# Altium project LIB_TEST.PrjPcb (part 3 of 4)
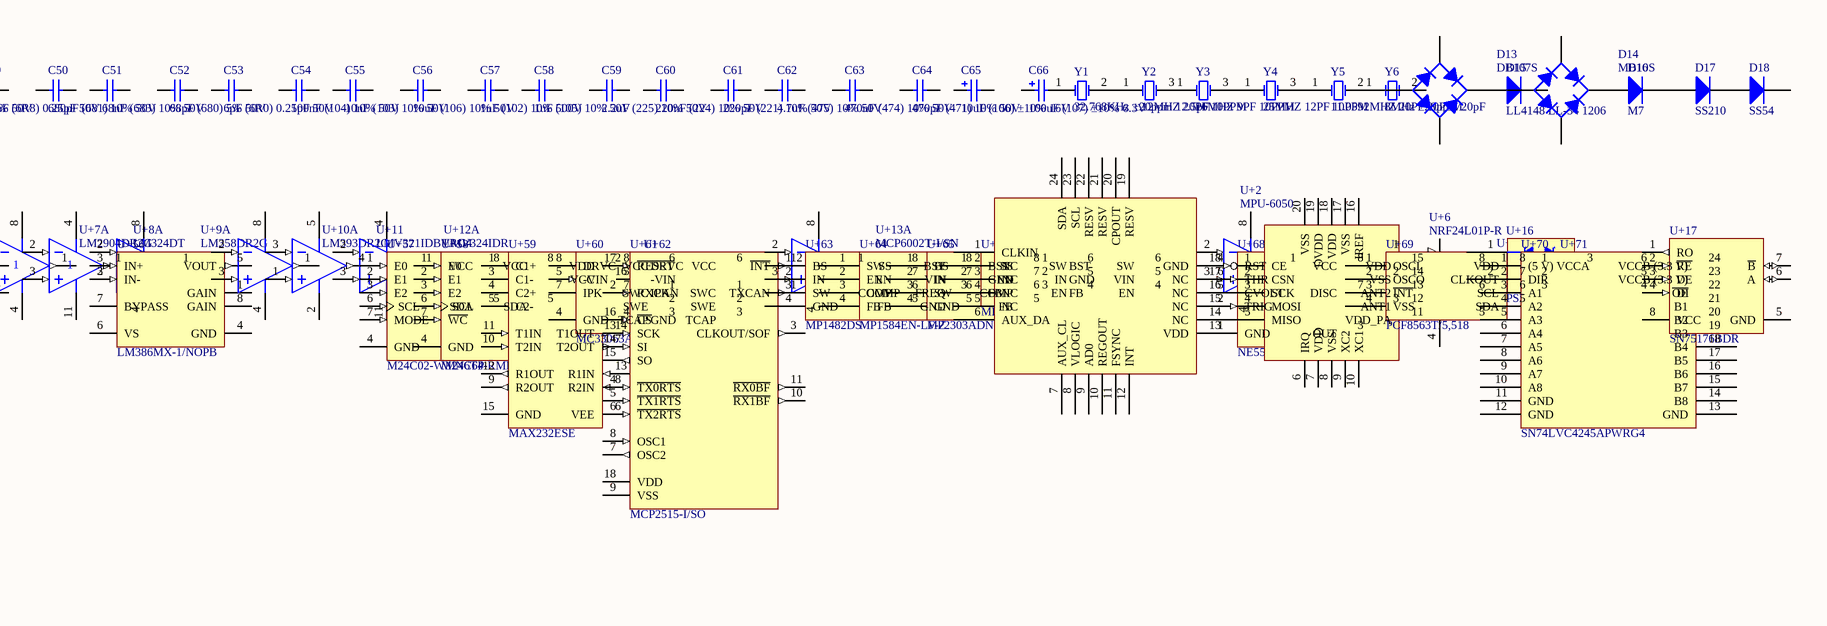
[diagram p7: 3.SchDoc, right]

## Sheet 3.SchDoc (continued)

### Nets
NetC45_2: C45.2 U+1.48(SEG0)
NetD16_2: D16.2(K) D17.1(A)
NetD20_2: D20.2(K) D21.1(A)
NetD21_2: D21.2(K) D22.1(A)
NetL24_2: L24.2 U+41.7(VEE)
NetL25_2: L25.2 U+42.7(VEE)
NetL26_2: L26.2 U+43.7(VEE)
NetU+2_14: U+2.14(NC) U+6.5(MISO)
NetU+2_15: U+2.15(NC) U+6.4(MOSI)
NetU+2_16: U+2.16(NC) U+6.3(SCK)
NetU+2_17: U+2.17(NC) U+6.2(CSN)
NetU+2_18: U+2.18(GND) U+6.1(CE)
NetU+4_1: U+4.1(RI) U+15.16(VCC)
NetU+4_2: U+4.2(GND) U+15.10(R232)
NetU+4_3: U+4.3(D+) U+15.11(RTS#)
NetU+4_4: U+4.4(D-) U+15.12(DTR#)
NetU+4_5: U+4.5(VIO) U+15.13(DCD#)
NetU+4_6: U+4.6(VDD) U+15.14(RI#)
NetU+9_3: U+9.3(IN+) U+56.2(IN-)
NetU+13_3: U+13.3(VINA+) U+63.2(IN)
NetU+15_1: U+15.1(GND) U+43.11(A)
NetU+15_2: U+15.2(TXD) U+43.10(B)
NetU+15_3: U+15.3(RXD) U+43.9(C)
NetU+15_4: U+15.4(V3.3) U+43.6(~{EN})
NetU+15_6: U+15.6(UD-) U+43.12(X0)
NetU+15_7: U+15.7(XI) U+43.13(X1)
NetU+21_6: U+21.6(OUT) U+34.3(1Z)
NetU+21_8: U+21.8(RG) U+34.1(1A)
NetU+24_7: U+24.7(~{Y}7) U+25.7(GND)
NetU+24_11: U+24.11(~{Y}4) U+25.8(CLK)
NetU+24_12: U+24.12(~{Y}3) U+25.9(~{CLR})
NetU+24_14: U+24.14(~{Y}1) U+25.2(B)
NetU+24_15: U+24.15(~{Y}0) U+25.1(A)
NetU+28_15: U+28.15(B3) U+74.48(AGND)
NetU+29_16: U+29.16(Q4) U+74.43(PMODE2)
NetU+30_4: U+30.4(QE) U+74.39(RSVD)
NetU+32_7: U+32.7(PV) U+74.40(RSVD)
NetU+34_13: U+34.13(4Z) U+37.4(R)
NetU+34_14: U+34.14(4Y) U+37.3(VCC)
NetU+34_15: U+34.15(4A) U+37.2(GND)
NetU+34_16: U+34.16(VCC) U+37.1(D)
NetU+35_13: U+35.13(4Y) U+38.4(RXD)
NetU+35_14: U+35.14(4A) U+38.3(VCC)
NetU+35_15: U+35.15(4B) U+38.2(GND)
NetU+35_16: U+35.16(VCC) U+38.1(TXD)
NetU+36_5: U+36.5(Vref) U+39.4(RXD)
NetU+36_6: U+36.6(CANL) U+39.3(VCC)
NetU+36_7: U+36.7(CANH) U+39.2(GND)
NetU+36_8: U+36.8(Rs) U+39.1(TXD)
NetU+37_5: U+37.5(Vref) U+40.4(RXD)
NetU+37_6: U+37.6(CANL) U+40.3(VCC)
NetU+37_7: U+37.7(CANH) U+40.2(GND)
NetU+37_8: U+37.8(RS) U+40.1(TXD)
NetU+46_2: U+46.2(X1) U+47.3(~{INT}/SQW)
NetU+46_3: U+46.3(X2) U+47.4(~{RST})
NetU+46_4: U+46.4(GND) U+47.6(N.C.)
NetU+46_5: U+46.5(~{RST}) U+47.2(VCC)
NetU+46_7: U+46.7(SCLK) U+47.1(32KHZ)
NetU+50_4: U+50.4(VCCIO) U+73.1(A)
NetU+51_4: U+51.4(EN) U+52.3(GND)
NetU+51_5: U+51.5(VCC) U+52.2(CAP+)
NetU+51_6: U+51.6(OC) U+52.1(NC)
NetU+63_6: U+63.6(COMP) U+66.3(FB)
NetU+63_7: U+63.7(EN) U+66.2(GND)
NetU+63_8: U+63.8(SS) U+66.1(BST)
NetU+75_1: U+75.1(OUT) U+83.1(GRID12)
NetU+81_18: U+81.18(DIN) U+84.3(BAT)
NetU+81_19: U+81.19(CLK) U+84.2(GND)
NetU+81_20: U+81.20(STB) U+84.1(~{GHRG})
NetU+82_25: U+82.25(GND) U+85.4(VCC)
NetU+82_26: U+82.26(DIO) U+85.3(GND)
NetU+82_27: U+82.27(CLK) U+85.2(PROG)
NetU+82_28: U+82.28(STB) U+85.1(TEMP)
NetU+84_4: U+84.4(VCC) U+87.3(NC)
NetU+84_5: U+84.5(PROG) U+87.1(BOOT)
NetU+85_5: U+85.5(BAT) U+88.4(SS)
NetU+85_6: U+85.6(~{STDBY}) U+88.3(EN)
NetU+85_7: U+85.7(~{CHRG}) U+88.2(VIN)
NetU+85_8: U+85.8(CE) U+88.1(BOOT)
NetU+89_4: U+89.4(EN) U+92.3(~{WP})
NetU+89_5: U+89.5(VIN) U+92.1(~{CS})
NetY1_2: Y1.2(OSC2) Y2.1(OSC1)
NetY3_3: Y3.3(OSC2) Y4.1(OSC1)
NetY4_3: Y4.3(OSC2) Y5.1(OSC1)

Not connected (* = marked no-connect by the designer): C1 1 2; C2 1 2; C3 1 2; C4 1 2; C5 1 2; C6 1 2; C7 1 2; C8 1 2; C9 1 2; C10 1 2; C11 1 2; C12 1 2; C13 1 2; C14 1 2; C15 1 2; C16 1 2; C17 1 2; C18 1 2; C19 1 2; C20 1 2; C21 1 2; C22 1 2; C23 1 2; C24 1 2; C25 1 2; C26 1 2; C27 1 2; C28 1 2; C29 1 2; C30 1 2; C31 1 2; C32 1 2; C33 1 2; C34 1 2; C35 1 2; C36 1 2; C37 1 2; C38 1 2; C39 1 2; C40 1 2; C41 1 2; C42 1 2; C43 1 2; C44 1 2; C45 1; C46 1 2; C47 1 2; C48 1 2; C49 1 2; C50 1 2; C51 1 2; C52 1 2; C53 1 2; C54 1 2; C55 1 2; C56 1 2; C57 1 2; C58 1 2; C59 1 2; C60 1 2; C61 1 2; C62 1 2; C63 1 2; C64 1 2; C65 1 2; C66 1 2; D13 1(C) 2(K) 3(C) 4(A); D14 1(C) 2(K) 3(C) 4(A); D15 1(A) 2(K); D16 1(A); D17 2(K); D18 1(A) 2(K); D19 1(A) 2(K); D20 1(A); D22 2(K); D23 1(A) 2(K); D24 1(A) 2(A) 3(K); D25 1(A) 2(A) 3(K); L16 1 2; L17 1 2; L18 1 2; L19 1 2; L20 1 2; L21 1 2; L22 1 2; L23 1 2; L24 1; L25 1; L26 1; L27 1 2; L28 1 2; L29 1 2; L30 1 2; L31 1 2; L32 1 2; L33 1 2; L34 1 2; L35 1 2; U+1 1(~{CS}) 2(~{RD}) 3(~{WR}) 4(DATA) 5(VSS) 6(OSCO) 7(OSCI) 8(VLCD) 9(VDD) 10(~{IRQ}) 11(BZ) 12(~{BZ}) 13(COM0) 14(COM1) 15(COM2) 16(COM3) 17(SEG31) 18(SEG30) 19(SEG29) 20(SEG28) 21(SEG27) 22(SEG26) 23(SEG25) 24(SEG24) 25(SEG23) 26(SEG22) 27(SEG21) 28(SEG20) 29(SEG19) 30(SEG18) 31(SEG17) 32(SEG16) 33(SEG15) 34(SEG14) 35(SEG13) 36(SEG13) 37(SEG12) 38(SEG10) 39(SEG9) 40(SEG8) 41(SEG7) 42(SEG6) 43(SEG5) 44(SEG4) 45(SEG3) 46(SEG2) 47(SEG1); U+2 1(CLKIN) 2(NC) 3(NC) 4(NC) 5(NC) 6(AUX_DA) 7(AUX_CL) 8(VLOGIC) 9(AD0) 10(REGOUT) 11(FSYNC) 12(INT) 13(VDD) 19(RESV) 20(CPOUT) 21(RESV) 22(RESV) 23(SCL) 24(SDA); U+3 1(DCD) 2(R1) 3(GND) 4(D+) 5(D-) 6(VDD) 7(REGIN) 8(VBUS) 9(~{RST}) 11(SUSPEND) 12(~{SUSPEND}) 23(CTS) 24(RTS) 25(RXD) 26(TXD) 27(DSR) 28(DTR); U+4 7(REGIN) 8(VBUS) 9(~{RST}) 10(NC) 11(GPIO.3) 12(GPIO.2) 13(GPIO.1) 14(GPIO.0) 15(~{SUSPEND}) 16(VPP) 17(SUSPEND) 18(CTS) 19(RTS) 20(RXD) 21(TXD) 22(DSR) 23(DTR) 24(DCD); U+5 1(GND) 2(GND) 3(GND) 4(GND) 5(P1_5) 6(P1_4) 7(P1_3) 8(P1_2) 9(P1_1) 10(DVDD2) 11(P1_0) 12(P0_7) 13(P0_6) 14(P0_5) 15(P0_4) 16(P0_3) 17(P0_2) 18(P0_1) 19(P0_0) 20(RESET_N) 21(AVDD5) 22(XOSC_Q1) 23(XOSC_Q2) 24(AVDD3) 25(RF_P) 26(RF_N) 27(AVDD2) 28(AVDD1) 29(AVDD4) 30(RBIAS) 31(AVDD6) 32(P2_4/XOSC32K_Q1) 33(P2_3/XOSC32K_Q2) 34(P2_2) 35(P2_1) 36(P2_0) 37(P1_7) 38(P1_6) 39(DVDD1) 40(DCOUPL); U+6 6(IRQ) 7(VDD) 8(VSS) 9(XC2) 10(XC1) 11(VDD_PA) 12(ANT1) 13(ANT2) 14(VSS) 15(VDD) 16(IREF) 17(VSS) 18(VDD) 19(DVDD) 20(VSS); U+7 1(OUT) 2(IN-) 3(IN+) 4(V-) 8(V+); U+8 1(OUT) 2(IN-) 3(IN+) 4(V+) 11(V-); U+9 1(OUT) 2(IN-) 4(V-) 8(V+); U+10 1(OUT) 2(IN-) 3(IN+) 4(GND) 8(V+); U+11 1(IN+) 2(V-) 3(IN-) 4(OUT) 5(V+); U+12 1(OUTA) 2(INA-) 3(INA+) 4(V+) 11(V-); U+13 1(VOUTA) 2(VINA-) 4(VSS) 8(VDD); U+14 1(OUT) 2(IN-) 3(IN+) 4(V-) 8(V+); U+15 5(UD+) 8(XO) 9(CTS#) 15(DSR#); U+16 1 2 3; U+17 1(RO) 2(~{RE}) 3(DE) 4(DI) 5(GND) 6(A) 7(~{B}) 8(VCC); U+18 1(A) 2(Y) 7(GND) 14(VDD); U+19 1(A) 2(B) 3(Y) 7(GND) 14(VDD); U+20 1(A) 2(Y) 7(GND) 14(VDD); U+21 1(RG) 2(-IN) 3(+IN) 4(V-) 5(REF) 7(V+); U+22 1(R) 2(K) 3(A); U+23 1(VOSTRIM) 2(IN-) 3(IN+) 4(V-) 5(NC) 6(OUT) 7(V+) 8(VOSTRIM); U+24 1(A) 2(B) 3(C) 4(~{OE}2A) 5(~{OE}2B) 6(OE1) 8(GND) 9(~{Y}6) 10(~{Y}5) 13(~{Y}2) 16(VCC); U+25 3(QA) 4(QB) 5(QC) 6(QD) 10(QE) 11(QF) 12(QG) 13(QH) 14(VCC); U+26 1(S/L) 2(CLK) 3(E) 4(F) 5(G) 6(H) 7(~{QH}) 8(GND) 9(QH) 10(SI) 11(A) 12(B) 13(C) 14(D) 15(CLK_INH) 16(VCC); U+27 1(~{OE}1) 2(A1) 3(Y8) 4(A2) 5(Y7) 6(A3) 7(Y6) 8(A4) 9(Y5) 10(GND) 11(A5) 12(Y4) 13(A6) 14(Y3) 15(A7) 16(Y2) 17(A8) 18(Y1) 19(~{OE}2) 20(VCC); U+28 1(T/~{R}) 2(A0) 3(A1) 4(A2) 5(A3) 6(A4) 7(A5) 8(A6) 9(A7) 10(GND) 11(B7) 12(B6) 13(B5) 14(B4) 16(B2) 17(B1) 18(B0) 19(~{OE}) 20(VCC); U+29 1(~{OE}) 2(D1) 3(D2) 4(D3) 5(D4) 6(D5) 7(D6) 8(D7) 9(D8) 10(GND) 11(LE) 12(Q8) 13(Q7) 14(Q6) 15(Q5) 17(Q3) 18(Q2) 19(Q1) 20(VCC); U+30 1(QB) 2(QC) 3(QD) 5(QF) 6(QG) 7(QH) 8(GND) 9(QH') 10(~{SRCLR}) 11(SRCLK) 12(RCLK) 13(~{OE}) 14(SER) 15(QA) 16(VCC); U+31 1(IP+) 2(IP+) 3(IP–) 4(IP-) 5(GND) 6(FILTER) 7(VIOUT) 8(VCC); U+32 1(VDD1) 2(GND1) 3(RxD) 4(~{RE}) 5(DE) 6(TxD) 8(GND1) 9(GND2) 10(NC) 11(NC) 12(A) 13(B) 14(NC) 15(GND2) 16(VDD2); U+33 1(VDD1) 2(VIA) 3(VIB) 4(GND1) 5(GND2) 6(VOB) 7(VOA) 8(VDD2); U+34 2(1Y) 4(G) 5(2Z) 6(2Y) 7(2A) 8(GND) 9(3A) 10(3Y) 11(3Z) 12(~{G}); U+35 1(1B) 2(1A) 3(1Y) 4(G) 5(2Y) 6(2A) 7(2B) 8(GND) 9(3B) 10(3A) 11(3Y) 12(~{G}); U+36 1(TXD) 2(GND) 3(VCC) 4(RXD); U+38 5(SPLIT) 6(CANL) 7(CANH) 8(STB); U+39 5(n.c.) 6(CANL) 7(CANH) 8(S); U+40 5(VIO) 6(CANL) 7(CANH) 8(S); U+41 1(X4) 2(X6) 3(X) 4(X7) 5(X5) 6(~{EN}) 8(GND) 9(C) 10(B) 11(A) 12(X3) 13(X0) 14(X1) 15(X2) 16(VCC); U+42 1(Y0) 2(Y2) 3(Y) 4(Y3) 5(Y1) 6(~{EN}) 8(GND) 9(B) 10(A) 11(X3) 12(X0) 13(X) 14(X1) 15(X2) 16(VCC); U+43 1(Y1) 2(Y0) 3(Z1) 4(Z) 5(Z0) 8(GND) 14(X) 15(Y) 16(VCC); U+44 1(INT#) 2(RSTI) 3(WR#) 4(RD#) 5(TXD) 6(RXD) 7(SD_DI) 8(A0) 9(V3) 10(UD+) 11(UD-) 12(GND) 13(XI) 14(XO) 15(D0) 16(D1) 17(D2) 18(SCS/D3) 19(BZ/D4) 20(SCK/D5) 21(SDI/D6) 22(SDO/D7) 23(SD_CS) 24(ACT#) 25(SD_DO) 26(SD_CK) 27(PCS#) 28(VCC); U+45 1(TX_CLK) 2(TX_EN) 3(TXD_0) 4(TXD_1) 5(TXD_2) 6(TXD_3/SNI_MODE) 7(PWR_DOWN/INT) 8(TCK) 9(TDO) 10(TMS) 11(TRST#) 12(TDI) 13(RD-) 14(RD+) 15(AGND) 16(TD-) 17(TD+) 18(PFBIN1) 19(AGND) 20(RESERVED) 21(RESERVED) 22(AVDD33) 23(PFBOUT) 24(RBIAS) 25(25MHz_OUT) 26(LED_ACT/COL/AN_EN) 27(LED_SPEED/AN1) 28(LED_LINK/AN0) 29(RESET_N) 30(MDIO) 31(MDC) 32(IOVDD3) 33(X2) 34(X1) 35(IOGND) 36(DGND) 37(PFBIN2) 38(RX_CLK) 39(RX_DV/MII_MODE) 40(CRS/CRS_DV/LED_CFG) 41(RX_ER/MDIX_EN) 42(COL/PHYAD0) 43(RXD_0/PHYAD1) 44(RXD_1/PHYAD2) 45(RXD_2/PHYAD3) 46(RXD_3/PHYAD4) 47(IOGND) 48(IOVDD33); U+46 1(VCC2) 6(I/O) 8(VCC1); U+47 5(N.C.) 7(N.C.) 8(N.C.) 9(N.C.) 10(N.C.) 11(N.C.) 12(N.C.) 13(GND) 14(VBAT) 15(SDA) 16(SCL); U+48 1(OD) 2(CS) 3(OC) 4(TD) 5(VCC) 6(GND); U+49 1(A0) 2(A1) 3(A3) 4(GND) 5(SDA) 6(SCL) 7(WP) 8(VCC); U+50 1(TXD) 2(DTR#) 3(RTS#) 5(RXD) 6(RI#) 7(GND) 8(NC) 9(DSR#) 10(DCD#) 11(CTS#) 12(SLEEP#) 13(TXDEN#) 14(PWREN#) 15(USBDP) 16(USBDM) 17(3V3OUT) 18(GND) 19(RESET#) 20(VCC) 21(GND) 22(RXLED#) 23(TXLED#) 24(NC) 25(AGND) 26(TEST) 27(OSCI) 28(OXCO); U+51 1(LX) 2(GND) 3(FB); U+52 4(CAP-) 5(VOUT) 6(LV) 7(OSC) 8(V+); U+53 1(VCC1) 2(RXD) 3(TXD) 4(GND1) 5(GND2) 6(CANL) 7(CANH) 8(VCC2); U+54 1(VIN) 2(OUT) 3(GND) 4(FB) 5(~{ON}/OFF); U+55 1(VIN) 2(OUT) 3(GND) 4(FB) 5(~{ON}/OFF); U+56 1(GAIN) 3(IN+) 4(GND) 5(VOUT) 6(VS) 7(BYPASS) 8(GAIN); U+57 1(E0) 2(E1) 3(E2) 4(GND) 5(SDA) 6(SCL) 7(MODE) 8(VCC); U+58 1(E0) 2(E1) 3(E2) 4(GND) 5(SDA) 6(SCL) 7(~{WC}) 8(VCC); U+59 1(C1+) 2(VDD) 3(C1-) 4(C2+) 5(C2-) 6(VEE) 7(T2OUT) 8(R2IN) 9(R2OUT) 10(T2IN) 11(T1IN) 12(R1OUT) 13(R1IN) 14(T1OUT) 15(GND) 16(VCC); U+60 1(SWC) 2(SWE) 3(TCAP) 4(GND) 5(-VIN) 6(VCC) 7(IPK) 8(DRVC); U+61 1(TXCAN) 2(RXCAN) 3(CLKOUT/SOF) 4(~{TX0RTS}) 5(~{TX1RTS}) 6(~{TX2RTS}) 7(OSC2) 8(OSC1) 9(VSS) 10(~{RX1BF}) 11(~{RX0BF}) 12(~{INT}) 13(SCK) 14(SI) 15(SO) 16(~{CS}) 17(~{RESET}) 18(VDD); U+62 1(SWC) 2(SWE) 3(TCAP) 4(GND) 5(-VIN) 6(VCC) 7(IPK) 8(DRVC); U+63 1(BS) 3(SW) 4(GND) 5(FB); U+64 1(SW) 2(EN) 3(COMP) 4(FB) 5(GND) 6(FREQ) 7(VIN) 8(BST); U+65 1(BS) 2(IN) 3(SW) 4(GND) 5(FB) 6(COMP) 7(EN) 8(SS); U+66 4(EN) 5(IN) 6(SW); U+67 1(BST) 2(GND) 3(FB) 4(EN) 5(VIN) 6(SW); U+68 1(GND) 2(TRIG) 3(OUT) 4(RST) 5(CVOLT) 6(THR) 7(DISC) 8(VCC); U+69 1(OSCI) 2(OSCO) 3(~{INT}) 4(VSS) 5(SDA) 6(SCL) 7(CLKOUT) 8(VDD); U+70 1((5_V)_VCCA) 2(DIR) 3(A1) 4(A2) 5(A3) 6(A4) 7(A5) 8(A6) 9(A7) 10(A8) 11(GND) 12(GND) 13(GND) 14(B8) 15(B7) 16(B6) 17(B5) 18(B4) 19(B3) 20(B2) 21(B1) 22(~{OE}) 23(VCCB_(3.3_V)) 24(VCCB_(3.3_V)); U+71 1 2 3 4 5 6; U+72 1(NC) 2(A) 3(K) 4(NC) 5(GND) 6(VO) 7(VE) 8(VCC); U+73 2(K) 3(E) 4(C); U+74 1(TXN) 2(TXP) 3(AGND) 4(AVDD) 5(RXN) 6(RXP) 7(DNC) 8(AVDD) 9(AGND) 10(EXRES1) 11(AVDD) 12(NC) 13(NC) 14(AGND) 15(AVDD) 16(AGND) 17(AVDD) 18(VBG) 19(AGND) 20(TOCAP) 21(AVDD) 22(1V2O) 23(RSVD) 24(SPDLED) 25(LINKLED) 26(DUPLED) 27(ACTLED) 28(VDD) 29(GND) 30(XI/CLCKIN) 31(XO) 32(SCSn) 33(SCLK) 34(MISO) 35(MOSI) 36(INTn) 37(RSTn) 38(RSVD) 41(RSVD) 42(RSVD) 44(PMODE1) 45(PMODE0) 46(NC) 47(NC); U+75 2(IN-) 3(IN+) 4(V-) 8(V+); U+76 1(RO) 2(~{RE}) 3(DE) 4(DI) 5(GND) 6(A) 7(~{B}) 8(VCC); U+77 1(RO) 2(~{RE}) 3(DE) 4(DI) 5(GND) 6(A) 7(~{B}) 8(VCC); U+78 1(C1+) 2(V+) 3(C1-) 4(C2+) 5(C2-) 6(V-) 7(T2OUT) 8(R2IN) 9(R2OUT) 10(T2IN) 11(T1IN) 12(R1OUT) 13(R1IN) 14(T1OUT) 15(GND) 16(VCC); U+79 1(I/O) 2(GND) 3(I/O) 4(I/O) 5(REF) 6(I/O); U+80 1(IN1+) 2(IN1-) 3(CMPEN) 4(DTC) 5(CT) 6(RT) 7(GND) 8(C1) 9(E1) 10(E2) 11(C2) 12(VCC) 13(CNTLO) 14(VREF) 15(IN2-) 16(IN2+); U+81 1(VDD) 2(SEG1) 3(SEG2) 4(SEG3) 5(SEG4) 6(SEG5) 7(SEG6) 8(SEG7) 9(SEG8) 10(GRID6) 11(GRID5) 12(GND) 13(GRID4) 14(GRID3) 15(GND) 16(GRID2) 17(GRID1); U+82 1(K1) 2(K2) 3(K3) 4(VDD) 5(SEG1/KS1) 6(SEG2/KS2) 7(SEG3/KS3) 8(SEG4/KS4) 9(SEG5/KS5) 10(SEG6/KS6) 11(SEG7/KS7) 12(SEG8/KS8) 13(SEG9) 14(SEG10) 15(VDD) 16(GR8) 17(GR7) 18(GND) 19(GR6) 20(GR5) 21(GR4) 22(GR3) 23(GR2) 24(GR1); U+83 2(GRID13) 3(GRID14) 4(GRID15) 5(GRID16) 6(VSS) 7(DIN) 8(SCLK) 9(SEG1) 10(SEG2) 11(SEG3) 12(SEG4) 13(SEG5) 14(SEG6) 15(SEG7) 16(SEG8) 17(VDD) 18(GRID1) 19(GRID2) 20(GRID3) 21(GRID4) 22(GRID5) 23(GRID6) 24(GRID7) 25(GRID8) 26(GRID9) 27(GRID10) 28(GRID11); U+86 1(CHRG) 2(GND) 3(BAT) 4(VCC) 5(STDBY) 6(PROG); U+87 2(NC) 4(VSENSE) 5(ENA) 6(GND) 7(VIN) 8(PH); U+88 5(VSENSE) 6(COMP) 7(GND) 8(PH); U+89 1(SW) 2(GND) 3(FB); U+90 1(CMPEN) 2(VFB) 3(ISEN) 4(RT/CT) 5(GND) 6(OUT) 7(VCC) 8(VREF); U+91 1(IN1) 2(IN2) 3(IN3) 4(IN4) 5(IN5) 6(IN6) 7(IN7) 8(GND) 9(COM) 10(OUT7) 11(OUT6) 12(OUT5) 13(OUT4) 14(OUT3) 15(OUT2) 16(OUT1); U+92 2(DO) 4(GND) 5(DI) 6(CLK) 7(~{HOLD}_ro_~{RESET}) 8(VCC); U+93 1(IN1) 2(IN2) 3(IN3) 4(IN4) 5(IN5) 6(IN6) 7(IN7) 8(IN8) 9(GND) 10(COM_D) 11(OUT8) 12(OUT7) 13(OUT6) 14(OUT5) 15(OUT4) 16(OUT3) 17(OUT2) 18(OUT1); U+94 1(VIN) 2(OUTPUT) 3(FEEDBACK) 4(ON/OFF) 5(GND) 6(GND) 7(GND) 8(GND); U+95 1(VIN) 2(OUTPUT) 3(FEEDBACK) 4(ON/OFF) 5(GND) 6(GND) 7(GND) 8(GND); Y1 1(OSC1); Y2 3(OSC2); Y3 1(OSC1); Y5 2(OSC2); Y6 1(OSC1) 2(OSC2)